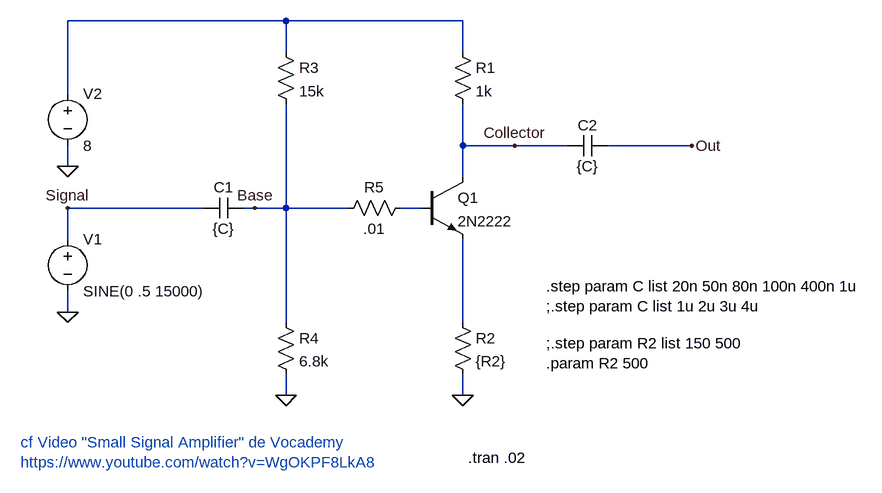
[diagram p0: schematic SmallSignalAmplifier2.asc]
SmallSignalAmplifier2.asc, the LTspice schematic file:
Version 4
SHEET 1 1272 680
WIRE 352 -176 16 -176
WIRE 624 -176 352 -176
WIRE 352 -128 352 -176
WIRE 624 -128 624 -176
WIRE 16 -64 16 -176
WIRE 624 16 624 -48
WIRE 704 16 624 16
WIRE 784 16 704 16
WIRE 976 16 848 16
WIRE 16 48 16 16
WIRE 624 64 624 16
WIRE 224 112 16 112
WIRE 304 112 288 112
WIRE 352 112 352 -48
WIRE 352 112 304 112
WIRE 448 112 352 112
WIRE 560 112 528 112
WIRE 16 160 16 112
WIRE 16 272 16 240
WIRE 352 288 352 112
WIRE 624 288 624 160
WIRE 352 400 352 368
WIRE 624 400 624 368
FLAG 16 272 0
FLAG 16 48 0
FLAG 352 400 0
FLAG 624 400 0
FLAG 16 112 Signal
FLAG 976 16 Out
FLAG 304 112 Base
FLAG 704 16 Collector
SYMBOL voltage 16 144 R0
WINDOW 123 0 0 Left 0
WINDOW 39 0 0 Left 0
SYMATTR InstName V1
SYMATTR Value SINE(0 .5 15000)
SYMBOL voltage 16 -80 R0
WINDOW 123 0 0 Left 0
WINDOW 39 0 0 Left 0
SYMATTR InstName V2
SYMATTR Value 8
SYMBOL npn 560 64 R0
SYMATTR InstName Q1
SYMATTR Value 2N2222
SYMBOL res 608 -144 R0
SYMATTR InstName R1
SYMATTR Value 1k
SYMBOL res 608 272 R0
SYMATTR InstName R2
SYMATTR Value {R2}
SYMBOL res 336 -144 R0
SYMATTR InstName R3
SYMATTR Value 15k
SYMBOL res 336 272 R0
SYMATTR InstName R4
SYMATTR Value 6.8k
SYMBOL cap 288 96 R90
WINDOW 0 0 32 VBottom 2
WINDOW 3 32 32 VTop 2
SYMATTR InstName C1
SYMATTR Value {C}
SYMBOL cap 848 0 R90
WINDOW 0 0 32 VBottom 2
WINDOW 3 32 32 VTop 2
SYMATTR InstName C2
SYMATTR Value {C}
SYMBOL res 544 96 R90
WINDOW 0 0 56 VBottom 2
WINDOW 3 32 56 VTop 2
SYMATTR InstName R5
SYMATTR Value .01
TEXT -56 472 Left 2 ;cf Video "Small Signal Amplifier" de Vocademy\nhttps://www.youtube.com/watch?v=WgOKPF8LkA8
TEXT 632 496 Left 2 !.tran .02
TEXT 752 320 Left 2 !;.step param R2 list 150 500\n.param R2 500
TEXT 752 232 Left 2 !.step param C list 20n 50n 80n 100n 400n 1u\n;.step param C list 1u 2u 3u 4u

The netlist it stands for:
* SmallSignalAmplifier2.asc
V1 Signal 0 SINE(0 .5 15000)
V2 N001 0 8
Q1 Collector N002 N003 0 2N2222
R1 N001 Collector 1k
R2 N003 0 {R2}
R3 N001 Base 15k
R4 Base 0 6.8k
C1 Base Signal {C}
C2 Out Collector {C}
R5 N002 Base .01
.model NPN NPN
.model PNP PNP
.lib standard.bjt
* cf Video "Small Signal Amplifier" de Vocademy
* https://www.youtube.com/watch?v=WgOKPF8LkA8
.tran .02
;.step param R2 list 150 500
.param R2 500
.step param C list 20n 50n 80n 100n 400n 1u
;.step param C list 1u 2u 3u 4u
.backanno
.end